# Altium schematic sheet 1_Part_MCU.schdoc
size 426 x 304 mm; Symbol: Sheet-Symbol_A3; Device: Sheet-Symbol_A3; Convert to PCB: yes; Add into BOM: yes; Company: 深圳嘉立创科技发展有限公司; Drawed: 嘉立创EDA; Reviewed: 嘉立创EDA; Version: V0.1; Page Size: A3; @Project Name: Catch5Yeah; @Page Count: 1; @Update Date: 2022-01-23; @Create Date: 2022-01-23; @Schematic Name: Sch_MainBroad; Part Number: JLCPCB-001; @Page No: 1; @Page Name: P1
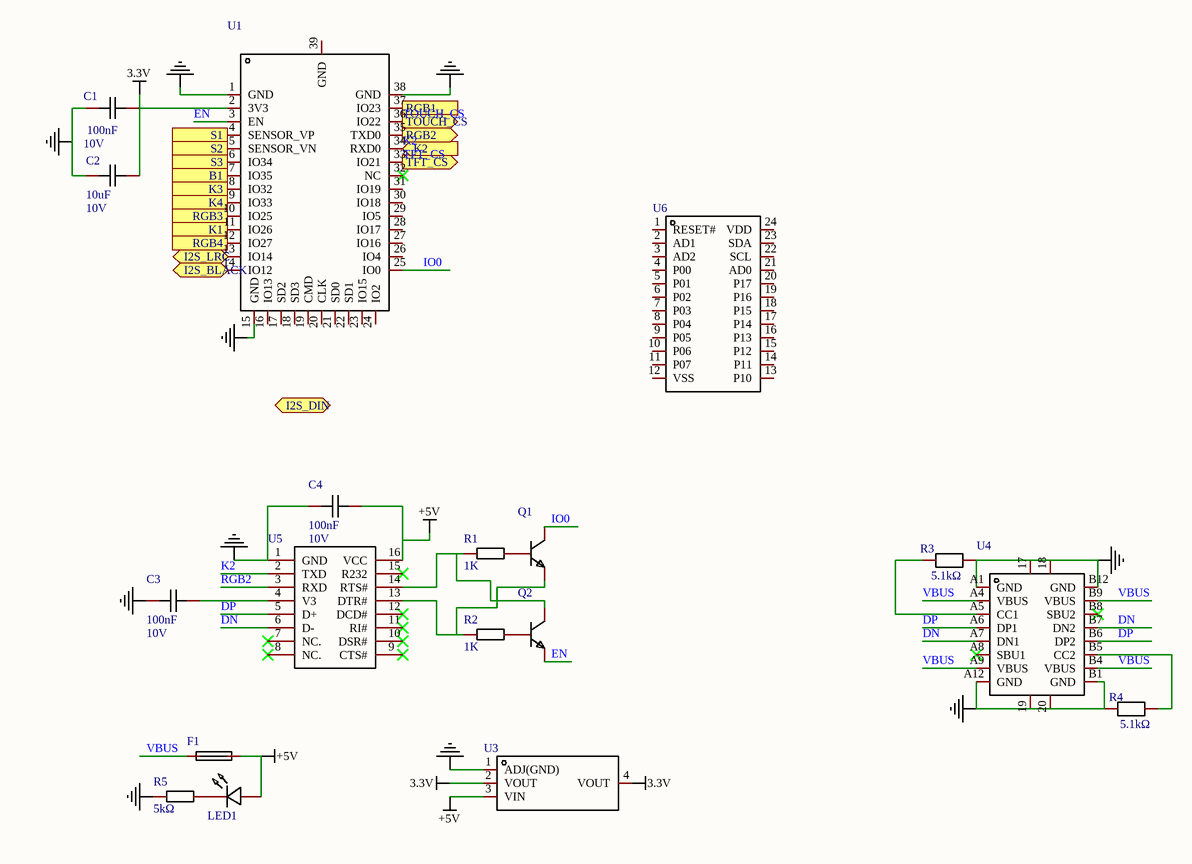
[diagram p0: 1_Part_MCU.schdoc]

## Parts
C1  value 100nF  Voltage Rated: 10V  [C0603]  (hidden comment: C0603T104K8RACM105)
C2  value 10uF  Voltage Rated: 10V  [C0603]  (hidden comment: C0603C102K1RAC3083)
C3  value 100nF  Voltage Rated: 10V  [C0603]  (hidden comment: C0603T104K8RACM105)
C4  value 100nF  Voltage Rated: 10V  [C0603]  (hidden comment: C0603T104K8RACM105)
F1  JK-SMD0603-010  [F0603]  (value not drawn)
LED1  HL-PST-1608S9AC  [LED0603-RD_RED]  (value not drawn)
Q1  S8050_C2846756  [SOT-23-3_L2.9-W1.6-P1.90-LS2.8-BR]  (value not drawn)
Q2  S8050_C2846756  [SOT-23-3_L2.9-W1.6-P1.90-LS2.8-BR]  (value not drawn)
R1  Resistance: 1K  [R0603]  (hidden comment: RR1608(0603)L4702FT)
R2  Resistance: 1K  [R0603]  (hidden comment: RR1608(0603)L4702FT)
R3  value 5.1kΩ  [R0402]  (hidden comment: SFR01MZPJ102)
R4  value 5.1kΩ  [R0402]  (hidden comment: SFR01MZPJ102)
R5  value 5kΩ  [R0603]  (hidden comment: RCT03470RJLF)
U1  ESP32-WROOM-32DC  [WIFIM-SMD_38P-L25.5-W18.0-P1.27]  (value not drawn)
U3  AMS1117-3.3_C2891839  [SOT-223-3_L6.5-W3.4-P2.30-LS7.0-BR]  (value not drawn)
U4  TYPE-C16PIN母座 板上四脚三次molding  [USB-SMD_TYPE-C16PIN]  (value not drawn)
U5  CH340C  [SOP-16_L10.0-W3.9-P1.27-LS6.0-BL]  (value not drawn)
U6  PCA9671PW,118  [TSSOP-24_L7.8-W4.4-P0.65-LS6.4-BL]  (value not drawn)

## Ports
B1 (in), I2S_BLACK (bidir), I2S_DIN (bidir), I2S_LRC (bidir), K1 (in), K2 (in), K3 (in), K4 (in), RGB1 (out), RGB2 (out), RGB3 (out), RGB4 (out), S1 (in), S2 (in), S3 (in), TFT_CS (out), TOUCH_CS (out)

## Nets
3.3V: C1.1 C2.2 U1.2(3V3) U3.2(VOUT) U3.4(VOUT)
+5V: C4.2 F1.2 LED1.2(+) U3.3(VIN) U5.16(VCC)
GND: C1.2 C2.1 C3.1 C4.1 R3.1 R4.2 R5.1 U1.1(GND) U1.15(GND) U1.38(GND) U3.1(ADJ(GND)) U4.17 U4.18 U4.19 U4.20 U4.A1(GND) U4.A12(GND) U4.B1(GND) U4.B12(GND) U5.1(GND)
B1: U1.7(IO35) ; port B1
DN: U4.A7(DN1) U4.B7(DN2) U5.6(D-)
DP: U4.A6(DP1) U4.B6(DP2) U5.5(D+)
EN: Q2.2(E) U1.3(EN)
IO0: Q1.3(C) U1.25(IO0)
K1: U1.11(IO26) ; port K1
K2: U1.34(RXD0) U5.2(TXD) ; port K2
K3: U1.8(IO32) ; port K3
K4: U1.9(IO33) ; port K4
RGB1: U1.37(IO23) ; port RGB1
RGB2: U1.35(TXD0) ; port RGB2
RGB2: U5.3(RXD)  [a separate net that carries the same name]
RGB3: U1.10(IO25) ; port RGB3
RGB4: U1.12(IO27) ; port RGB4
S1: U1.4(SENSOR_VP) ; port S1
S2: U1.5(SENSOR_VN) ; port S2
S3: U1.6(IO34) ; port S3
TFT_CS: U1.33(IO21) ; port TFT_CS
TOUCH_CS: U1.36(IO22) ; port TOUCH_CS
VBUS: F1.1 U4.A4(VBUS) U4.A9(VBUS) U4.B4(VBUS) U4.B9(VBUS)
NetC3_2: C3.2 U5.4(V3)
NetLED1_1: LED1.1(-) R5.2
NetQ1_1: Q1.1(B) R1.2
NetQ1_2: Q1.2(E) R2.1 U5.13(DTR#)
NetQ2_1: Q2.1(B) R2.2
NetQ2_3: Q2.3(C) R1.1 U5.14(RTS#)
NetR3_2: R3.2 U4.A5(CC1)
NetR4_1: R4.1 U4.B5(CC2)

Not connected (* = marked no-connect by the designer): U1 13(IO14) 14(IO12) 16(IO13) 17(SD2) 18(SD3) 19(CMD) 20(CLK) 21(SD0) 22(SD1) 23(IO15) 24(IO2) 26(IO4) 27(IO16) 28(IO17) 29(IO5) 30(IO18) 31(IO19) 32(NC)* 39(GND); U4 A8(SBU1)* B8(SBU2)*; U5 7(NC.)* 8(NC.)* 9(CTS#)* 10(DSR#)* 11(RI#)* 12(DCD#)* 15(R232)*; U6 1(RESET#) 2(AD1) 3(AD2) 4(P00) 5(P01) 6(P02) 7(P03) 8(P04) 9(P05) 10(P06) 11(P07) 12(VSS) 13(P10) 14(P11) 15(P12) 16(P13) 17(P14) 18(P15) 19(P16) 20(P17) 21(AD0) 22(SCL) 23(SDA) 24(VDD)

## Notes on the sheet
- 1
- 2
- 3
- 4
- 5
- 6
- A
- B
- C
- Schematic
- Sch_MainBroad
- Create Date
- Update Date
- 2022-01-23
- D
- Reviewed
- Drawed
- 嘉立创EDA
- P1
- Part Number
- Catch5Yeah
- JLCPCB-001
- VER
- SIZE
- PAGE
- OF
- V0.1
- A3
- 深圳嘉立创科技发展有限公司

## Library data of the parts
C1 C3 C4 = C0603T104K8RACM105: 容值:100nF;精度:±10%;额定电压:10V;温度系数:X7R;; Manufacturer: KEMET(基美); Add into BOM: yes; Tolerance: ±10%; Temperature Coefficient: X7R; Symbol: C0603T104K8RACM105; Device: C0603T104K8RACM105; LCSC Part Name: 100nF ±10% 10V; Supplier Part: C599801; Manufacturer Part: C0603T104K8RACM105; LCSC On Sale: 1; Supplier Footprint: 0603; JLCPCB Part Class: Extended Part; JLCPCB On Sale: 1; Datasheet: https://atta.szlcsc.com/upload/public/pdf/source/20200618/C599801_6A7797A5C6EA16E0B9ACCAB1F8F05D79.pdf; Supplier: LCSC; Convert to PCB: yes
C2 = C0603C102K1RAC3083: 容值:1nF;精度:±10%;额定电压:100V;温度系数:X7R;; Manufacturer: KEMET(基美); Add into BOM: yes; Tolerance: ±10%; Temperature Coefficient: X7R; Symbol: C0603C102K1RAC3083; Device: C0603C102K1RAC3083; LCSC Part Name: 1nF ±10% 100V; Supplier Part: C561818; Manufacturer Part: C0603C102K1RAC3083; LCSC On Sale: 1; Supplier Footprint: 0603; JLCPCB Part Class: Extended Part; JLCPCB On Sale: 1; Datasheet: https://atta.szlcsc.com/upload/public/pdf/source/20200618/C599608_2B9CFB7169FD5127D28BF69D59417288.pdf; Supplier: LCSC; Convert to PCB: yes
F1 = JK-SMD0603-010: 最大电压:15V;最大电流:40A;保持电流:100mA;跳闸电流:300mA;最大动作时间:1s;; Manufacturer: JK(金科); Add into BOM: yes; Operating Voltage (Max): 15V; Current Rating (Max): 40A; Hold Current: 100mA; Trip Current: 300mA; Maximum Time to Trip: 1s; Symbol: JK-SMD0603-010; Device: JK-SMD0603-010; LCSC Part Name: 贴片保险丝 0603 0.1A 15V 自恢复保险丝; Supplier Part: C369142; Manufacturer Part: JK-SMD0603-010; LCSC On Sale: 1; Supplier Footprint: 0603; JLCPCB Part Class: Extended Part; JLCPCB On Sale: 1; Datasheet: https://atta.szlcsc.com/upload/public/pdf/source/20190304/C369142_3AC558706C926C5FF846040D0168EEB1.pdf; Supplier: LCSC; Convert to PCB: yes
LED1 = HL-PST-1608S9AC: 发光颜色:红灯;; Manufacturer: HONGLITRONIC(鸿利光电); Add into BOM: yes; Emitted Color: 红灯; Symbol: HL-PST-1608S9AC; Device: HL-PST-1608S9AC; LCSC Part Name: 0603红色光626nm-636nm 10mA 亮度70MCD; Supplier Part: C497932; Manufacturer Part: HL-PST-1608S9AC; LCSC On Sale: 1; Supplier Footprint: SMD,1.6x0.8x0.68mm; JLCPCB Part Class: Extended Part; JLCPCB On Sale: 1; Datasheet: https://atta.szlcsc.com/upload/public/pdf/source/20200323/C497932_F44A6E07C5A6E88F0FBD8562C3D70046.pdf; Supplier: LCSC; Convert to PCB: yes
Q1 Q2 = S8050_C2846756: 晶体管类型:NPN;集射极击穿电压(Vceo):25V;集电极电流(Ic):500mA;功率(Pd):300mW;集电极-发射极饱和电压(VCE(sat)@Ic,Ib):600mV@500mA,50mA;直流电流增益(hFE@Ic,Vce):-;特征频率(fT):150MHz;工作温度:+150℃@(Tj);; Manufacturer: UMW(友台半导体); Manufacturer Part: S8050; Add into BOM: yes; Transistor Type: NPN; Collector-Emitter Breakdown Voltage (Vceo): 25V; Collector Current (Ic): 500mA; Power Dissipation (Pd): 300mW; Transition Frequency (fT): 150MHz; Symbol: S8050_C2846756; Device: S8050_C2846756; LCSC Part Name: S8050; Supplier Part: C2846756; LCSC On Sale: 1; Supplier Footprint: SOT-23; JLCPCB Part Class: Extended Part; JLCPCB On Sale: 0; Datasheet: https://atta.szlcsc.com/upload/public/pdf/source/20210713/C2846756_8430E3E7C0E68B0673137F8F61CD1D2D.pdf; Supplier: LCSC; Convert to PCB: yes; Collector-Emitter Saturation Voltage (VCE(sat)@Ic,Ib): 600mV@500mA,50mA; DC Current Gain (hFE@Ic,Vce): -; Operating Temperature: +150℃@(Tj)
R1 R2 = RR1608(0603)L4702FT: Add into BOM: yes; Symbol: RR1608(0603)L4702FT; Device: RR1608(0603)L4702FT; LCSC Part Name: RR1608(0603)L4702FT; Supplier Part: C2895577; Manufacturer Part: RR1608(0603)L4702FT; LCSC On Sale: 0; Supplier Footprint: R0603; JLCPCB Part Class: Extended Part; JLCPCB On Sale: 1; Supplier: LCSC; Convert to PCB: yes
R3 R4 = SFR01MZPJ102: 电阻类型:厚膜电阻;阻值:1kΩ;精度:±5%;功率:1/16W;温度系数:±100ppm/℃;最大工作电压:50V;工作温度范围:-55℃~+155℃;; Manufacturer: ROHM(罗姆); Add into BOM: yes; Tolerance: ±5%; Power(Watts): 1/16W; Overload Voltage (Max): 50V; Symbol: SFR01MZPJ102; Device: SFR01MZPJ102; LCSC Part Name: 1kΩ ±5% 1/16W; Supplier Part: C472874; Manufacturer Part: SFR01MZPJ102; LCSC On Sale: 1; Supplier Footprint: 0402; JLCPCB Part Class: Extended Part; JLCPCB On Sale: 1; Datasheet: https://atta.szlcsc.com/upload/public/pdf/source/20191223/C472874_56D7ED8D54136DF5DB7BFDD163F3DC91.pdf; Supplier: LCSC; Convert to PCB: yes; Type: 厚膜电阻; Temperature Coefficient: ±100ppm/℃; Operating Temperature Range: -55℃~+155℃
R5 = RCT03470RJLF: 阻值:470Ω;精度:±5%;功率:0.1W;温度系数:-;; Manufacturer: HKR(香港电阻); Add into BOM: yes; Tolerance: ±5%; Power(Watts): 0.1W; Symbol: RCT03470RJLF; Device: RCT03470RJLF; LCSC Part Name: 470Ω ±5% 0.1W; Supplier Part: C177340; Manufacturer Part: RCT03470RJLF; LCSC On Sale: 1; Supplier Footprint: 0603; JLCPCB Part Class: Extended Part; JLCPCB On Sale: 1; Datasheet: https://atta.szlcsc.com/upload/public/pdf/source/20180227/C177340_15197207374711371512.pdf; Supplier: LCSC; Convert to PCB: yes; Temperature Coefficient: -
U1 = ESP32-WROOM-32DC: ESP32-WROOM-32DC 是一款两层板设计模组，内置 ESP32-D0WD 芯片, 可用于低功耗传感器网络和复杂任务，例如语音编码、音频流和 MP3 解码等。该模组通过 SRRC/CE-RED/FCC 的 RF 认证。; Manufacturer: ESPRESSIF 乐鑫; Add into BOM: yes; Symbol: ESP32-WROOM-32DC; Device: ESP32-WROOM-32DC; LCSC Part Name: ESP32-WROOM-32DC 停产; Supplier Part: C473013; Manufacturer Part: ESP32-WROOM-32DC; LCSC On Sale: 0; Supplier Footprint: -; JLCPCB Part Class: Extended Part; JLCPCB On Sale: 0; Datasheet: https://atta.szlcsc.com/upload/public/pdf/source/20191226/C473013_13018072AE0665A63E6FE24975BA53A3.pdf; Supplier: LCSC; Convert to PCB: yes
U3 = AMS1117-3.3_C2891839: Manufacturer: YONGYUTAI(永裕泰); Add into BOM: yes; Symbol: AMS1117-3.3_C2891839; Device: AMS1117-3.3_C2891839; LCSC Part Name: AMS1117-3.3; Supplier Part: C2891839; Manufacturer Part: AMS1117-3.3; LCSC On Sale: 1; Supplier Footprint: SOT-223; JLCPCB Part Class: Extended Part; JLCPCB On Sale: 0; Datasheet: https://atta.szlcsc.com/upload/public/pdf/source/20210901/A75ADDE6A17DEE0002F2A58A8D1F3634.pdf; Supplier: LCSC; Convert to PCB: yes
U4 = TYPE-C16PIN母座 板上四脚三次molding: Add into BOM: yes; Symbol: TYPE-C16PIN母座 板上四脚三次MOLDING; Device: TYPE-C16PIN母座 板上四脚三次molding; LCSC Part Name: TYPE-C16PIN母座 板上四脚三次molding; Supplier Part: C9900000202; Manufacturer Part: TYPE-C16PIN母座 板上四脚三次molding; LCSC On Sale: 0; Supplier Footprint: TYPE-C16PIN; JLCPCB Part Class: Extended Part; JLCPCB On Sale: 1; Datasheet: 2021-09-15/03900G/aaf837f0873f462e9eab7ac60a9bb940/aac77-74p5r.pdf; Supplier: LCSC; Convert to PCB: yes
U5 = CH340C: 类型:Transceiver;协议类别:USB 2.0;驱动器/接收器数:-;数据速率:2Mbps;; Manufacturer: WCH(南京沁恒); Add into BOM: yes; Protocol: USB 2.0; Data Rate: 2Mbps; Supply Voltage: 3.3V, 5V; Symbol: CH340C; Device: CH340C; LCSC Part Name: CH340C; Supplier Part: C84681; Manufacturer Part: CH340C; LCSC On Sale: 1; Supplier Footprint: SOP-16_150mil; JLCPCB Part Class: Extended Part; JLCPCB On Sale: 1; Datasheet: https://atta.szlcsc.com/upload/public/pdf/source/20200819/C84681_ADBED554CE321879DBD6B1D06488689C.pdf; Supplier: LCSC; Convert to PCB: yes; Type: Transceiver; Number of Drivers/Receivers: -
U6 = PCA9671PW,118: I/O的数量:-;接口:-;特性:-;时钟频率:-;; Manufacturer: NXP(恩智浦); Add into BOM: yes; Symbol: PCA9671PW,118; Device: PCA9671PW,118; LCSC Part Name: PCA9671PW,118; Supplier Part: C2669689; Manufacturer Part: PCA9671PW,118; LCSC On Sale: 1; Supplier Footprint: TSSOP-24; JLCPCB Part Class: Extended Part; JLCPCB On Sale: 1; Datasheet: https://atta.szlcsc.com/upload/public/pdf/source/20211008/C2669689_232D57AF7EB62C16DDCCC00AE48AD7BB.pdf; Supplier: LCSC; Convert to PCB: yes; Number of I/O: -; Interface: -; Interrupt Output: -; Features: -; Output Type: -; Current - Output Source/Sink: -; Clock Frequency: -; Voltage - Supply: -; Operating Temperature: -; Mounting Type: -